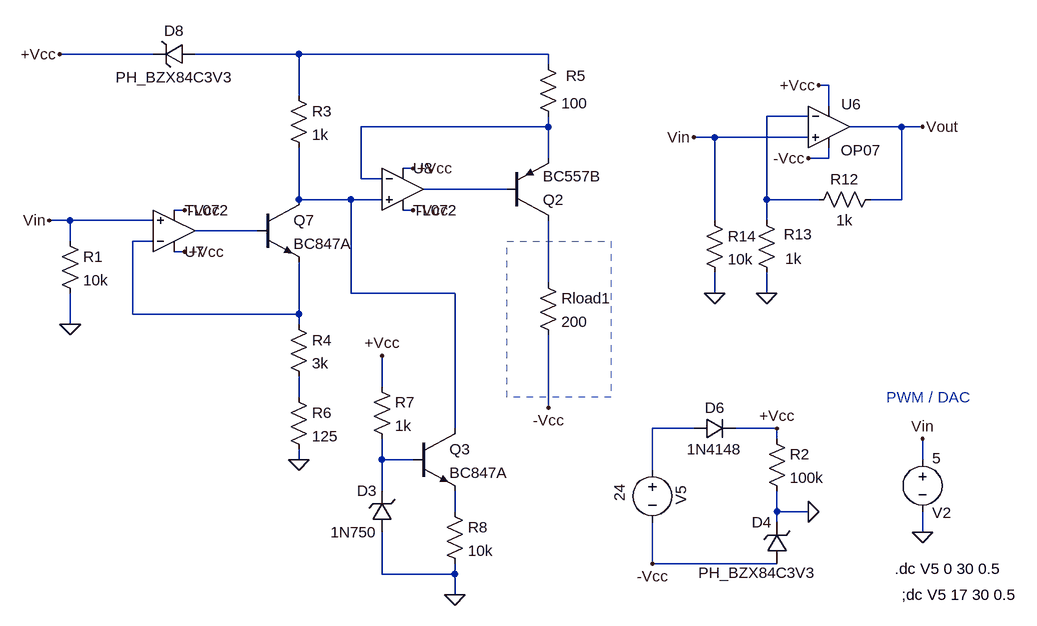
[diagram p0: schematic 420-transmitter-less.asc]
420-transmitter-less.asc, the LTspice schematic file:
Version 4
SHEET 1 5048 1864
WIRE 2432 -16 2288 -16
WIRE 2656 -16 2496 -16
WIRE 3040 -16 2656 -16
WIRE 3040 0 3040 -16
WIRE 3472 32 3456 32
WIRE 2656 48 2656 -16
WIRE 3472 64 3472 32
WIRE 3440 80 3376 80
WIRE 3040 96 3040 80
WIRE 3040 96 2752 96
WIRE 3584 96 3504 96
WIRE 3616 96 3584 96
WIRE 3296 112 3264 112
WIRE 3440 112 3296 112
WIRE 3040 144 3040 96
WIRE 3472 144 3472 128
WIRE 3472 144 3440 144
WIRE 2832 160 2816 160
WIRE 2752 176 2752 96
WIRE 2784 176 2752 176
WIRE 2976 192 2848 192
WIRE 2656 208 2656 128
WIRE 2736 208 2656 208
WIRE 2784 208 2736 208
WIRE 3376 208 3376 80
WIRE 3456 208 3376 208
WIRE 3584 208 3584 96
WIRE 3584 208 3536 208
WIRE 2480 224 2464 224
WIRE 2832 224 2816 224
WIRE 2304 240 2272 240
WIRE 2432 240 2304 240
WIRE 3296 240 3296 112
WIRE 3376 240 3376 208
WIRE 2592 256 2496 256
WIRE 2304 272 2304 240
WIRE 2432 272 2400 272
WIRE 2480 288 2464 288
WIRE 3040 336 3040 240
WIRE 2736 352 2736 208
WIRE 2896 352 2736 352
WIRE 3296 352 3296 320
WIRE 3376 352 3376 320
WIRE 2400 384 2400 272
WIRE 2656 384 2656 304
WIRE 2656 384 2400 384
WIRE 2304 400 2304 352
WIRE 2656 400 2656 384
WIRE 2784 496 2784 448
WIRE 2656 512 2656 480
WIRE 3040 528 3040 416
WIRE 2896 560 2896 352
WIRE 3264 560 3200 560
WIRE 3392 560 3328 560
WIRE 3392 576 3392 560
WIRE 2656 608 2656 592
WIRE 2784 608 2784 576
WIRE 2832 608 2784 608
WIRE 3616 608 3616 576
WIRE 3200 624 3200 560
WIRE 2784 656 2784 608
WIRE 2896 688 2896 656
WIRE 3392 688 3392 656
WIRE 3440 688 3392 688
WIRE 3392 704 3392 688
WIRE 3616 720 3616 688
WIRE 3200 768 3200 704
WIRE 3392 768 3200 768
WIRE 2784 784 2784 720
WIRE 2896 784 2896 768
WIRE 2896 784 2784 784
WIRE 2896 816 2896 784
FLAG 3392 560 +Vcc
FLAG 3616 720 0
FLAG 3616 576 Vin
FLAG 3376 352 0
FLAG 3264 112 Vin
FLAG 3456 32 +Vcc
FLAG 3440 144 -Vcc
FLAG 3616 96 Vout
FLAG 2288 -16 +Vcc
FLAG 2272 240 Vin
FLAG 2832 224 -Vcc
FLAG 2480 224 -Vcc
FLAG 2480 288 +Vcc
FLAG 2832 160 +Vcc
FLAG 3200 768 -Vcc
FLAG 3040 528 -Vcc
FLAG 2656 608 0
FLAG 2304 400 0
FLAG 3296 352 0
FLAG 2896 816 0
FLAG 3440 688 0
FLAG 2784 448 +Vcc
SYMBOL voltage 3616 592 R0
WINDOW 123 0 0 Left 0
WINDOW 39 0 0 Left 0
WINDOW 0 15 98 Left 2
WINDOW 3 15 14 Left 2
SYMATTR InstName V2
SYMATTR Value 5
SYMBOL pnp 2976 240 M180
SYMATTR InstName Q2
SYMATTR Value BC557B
SYMBOL res 3024 -16 R0
WINDOW 0 43 33 Left 2
SYMATTR InstName R5
SYMATTR Value 100
SYMBOL res 2640 32 R0
SYMATTR InstName R3
SYMATTR Value 1k
SYMBOL res 3024 320 R0
SYMATTR InstName Rload1
SYMATTR Value 200
SYMBOL Opamps\\OP07 3472 32 R0
WINDOW 0 19 29 Left 2
WINDOW 3 18 100 Left 2
SYMATTR InstName U6
SYMBOL voltage 3200 608 R0
WINDOW 123 0 0 Left 0
WINDOW 39 0 0 Left 0
WINDOW 0 44 40 VRight 2
WINDOW 3 -50 37 VRight 2
SYMATTR InstName V5
SYMATTR Value 24
SYMBOL zener 3408 768 R180
WINDOW 0 24 64 Left 2
WINDOW 3 -43 -14 Left 2
SYMATTR InstName D4
SYMATTR Value PH_BZX84C3V3
SYMBOL res 3376 560 R0
SYMATTR InstName R2
SYMATTR Value 100k
SYMBOL npn 2832 560 R0
SYMATTR InstName Q3
SYMATTR Value BC847A
SYMBOL zener 2800 720 R180
WINDOW 0 24 64 Left 2
WINDOW 3 24 0 Left 2
SYMATTR InstName D3
SYMATTR Value 1N750
SYMATTR Description Schottky diode
SYMATTR Type schottky
SYMBOL res 2768 480 R0
SYMATTR InstName R7
SYMATTR Value 1k
SYMBOL res 2640 384 R0
SYMATTR InstName R4
SYMATTR Value 3k
SYMBOL res 2640 496 R0
SYMATTR InstName R6
SYMATTR Value 125
SYMBOL res 2880 672 R0
SYMATTR InstName R8
SYMATTR Value 10k
SYMBOL res 2288 256 R0
SYMATTR InstName R1
SYMATTR Value 10k
SYMBOL res 3552 192 R90
WINDOW 0 0 56 VBottom 2
WINDOW 3 32 56 VTop 2
SYMATTR InstName R12
SYMATTR Value 1k
SYMBOL res 3392 336 R180
WINDOW 0 -55 75 Left 2
WINDOW 3 -38 37 Left 2
SYMATTR InstName R13
SYMATTR Value 1k
SYMBOL res 3280 224 R0
SYMATTR InstName R14
SYMATTR Value 10k
SYMBOL diode 3264 576 R270
WINDOW 0 32 32 VTop 2
WINDOW 3 0 32 VBottom 2
SYMATTR InstName D6
SYMATTR Value 1N4148
SYMBOL zener 2496 -32 R90
WINDOW 0 -4 32 VBottom 2
WINDOW 3 36 32 VTop 2
SYMATTR InstName D8
SYMATTR Value PH_BZX84C3V3
SYMBOL Opamps\\TL072 2816 128 R0
SYMATTR InstName U8
SYMBOL Opamps\\TL072 2464 320 M180
SYMATTR InstName U7
SYMBOL npn 2592 208 R0
SYMATTR InstName Q7
SYMATTR Value BC847A
TEXT 3736 776 Right 2 !.dc V5 0 30 0.5
TEXT 3560 512 Left 2 ;PWM / DAC
TEXT 3584 816 Left 2 !;dc V5 17 30 0.5
RECTANGLE Normal 3136 512 2976 272 2

The netlist it stands for:
* 420-transmitter-less.asc
V2 Vin 0 5
Q2 N008 N004 N003 0 BC557B
R5 N001 N003 100
R3 N001 N005 1k
Rload1 N008 -Vcc 200
XU6 Vin N002 +Vcc -Vcc Vout LT1001  ; OP07, pins In+ In- V+ V- OUT
V5 N010 -Vcc 24
D4 -Vcc 0 PH_BZX84C3V3
R2 +Vcc 0 100k
Q3 N005 N011 N012 0 BC847A
D3 0 N011 1N750
R7 +Vcc N011 1k
R4 N007 N009 3k
R6 N009 0 125
R8 N012 0 10k
R1 Vin 0 10k
R12 Vout N002 1k
R13 0 N002 1k
R14 Vin 0 10k
D6 N010 +Vcc 1N4148
D8 N001 +Vcc PH_BZX84C3V3
XU8 N005 N003 +Vcc -Vcc N004 TL072  ; pins In+ In- V+ V- OUT
XU7 Vin N007 +Vcc -Vcc N006 TL072  ; pins In+ In- V+ V- OUT
Q7 N005 N006 N007 0 BC847A
.model D D
.lib standard.dio
.model NPN NPN
.model PNP PNP
.lib standard.bjt
.dc V5 0 30 0.5
* PWM / DAC
;dc V5 17 30 0.5
.lib LTC.lib
.backanno
.end

* Results of the author's LTspice run, read from the files saved beside the schematic
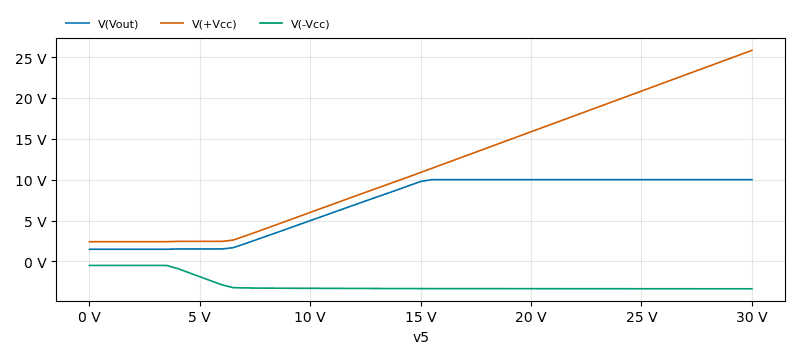
[diagram p1: DC transfer characteristic of 420-transmitter-less.asc, plotted from the saved traces]
* DC transfer characteristic, 1 run:
*   V(Vout): 1.483 V at v5=0 V, 10 V at v5=30 V, min 1.483 V, max 10 V
*   V(+Vcc): 2.41 V at v5=0 V, 25.82 V at v5=30 V, min 2.41 V, max 25.82 V
*   V(-Vcc): -496.9 mV at v5=0 V, -3.355 V at v5=30 V, min -3.355 V, max -496.9 mV